# EasyEDA Pro project 交换机工具.epro, board PCB3
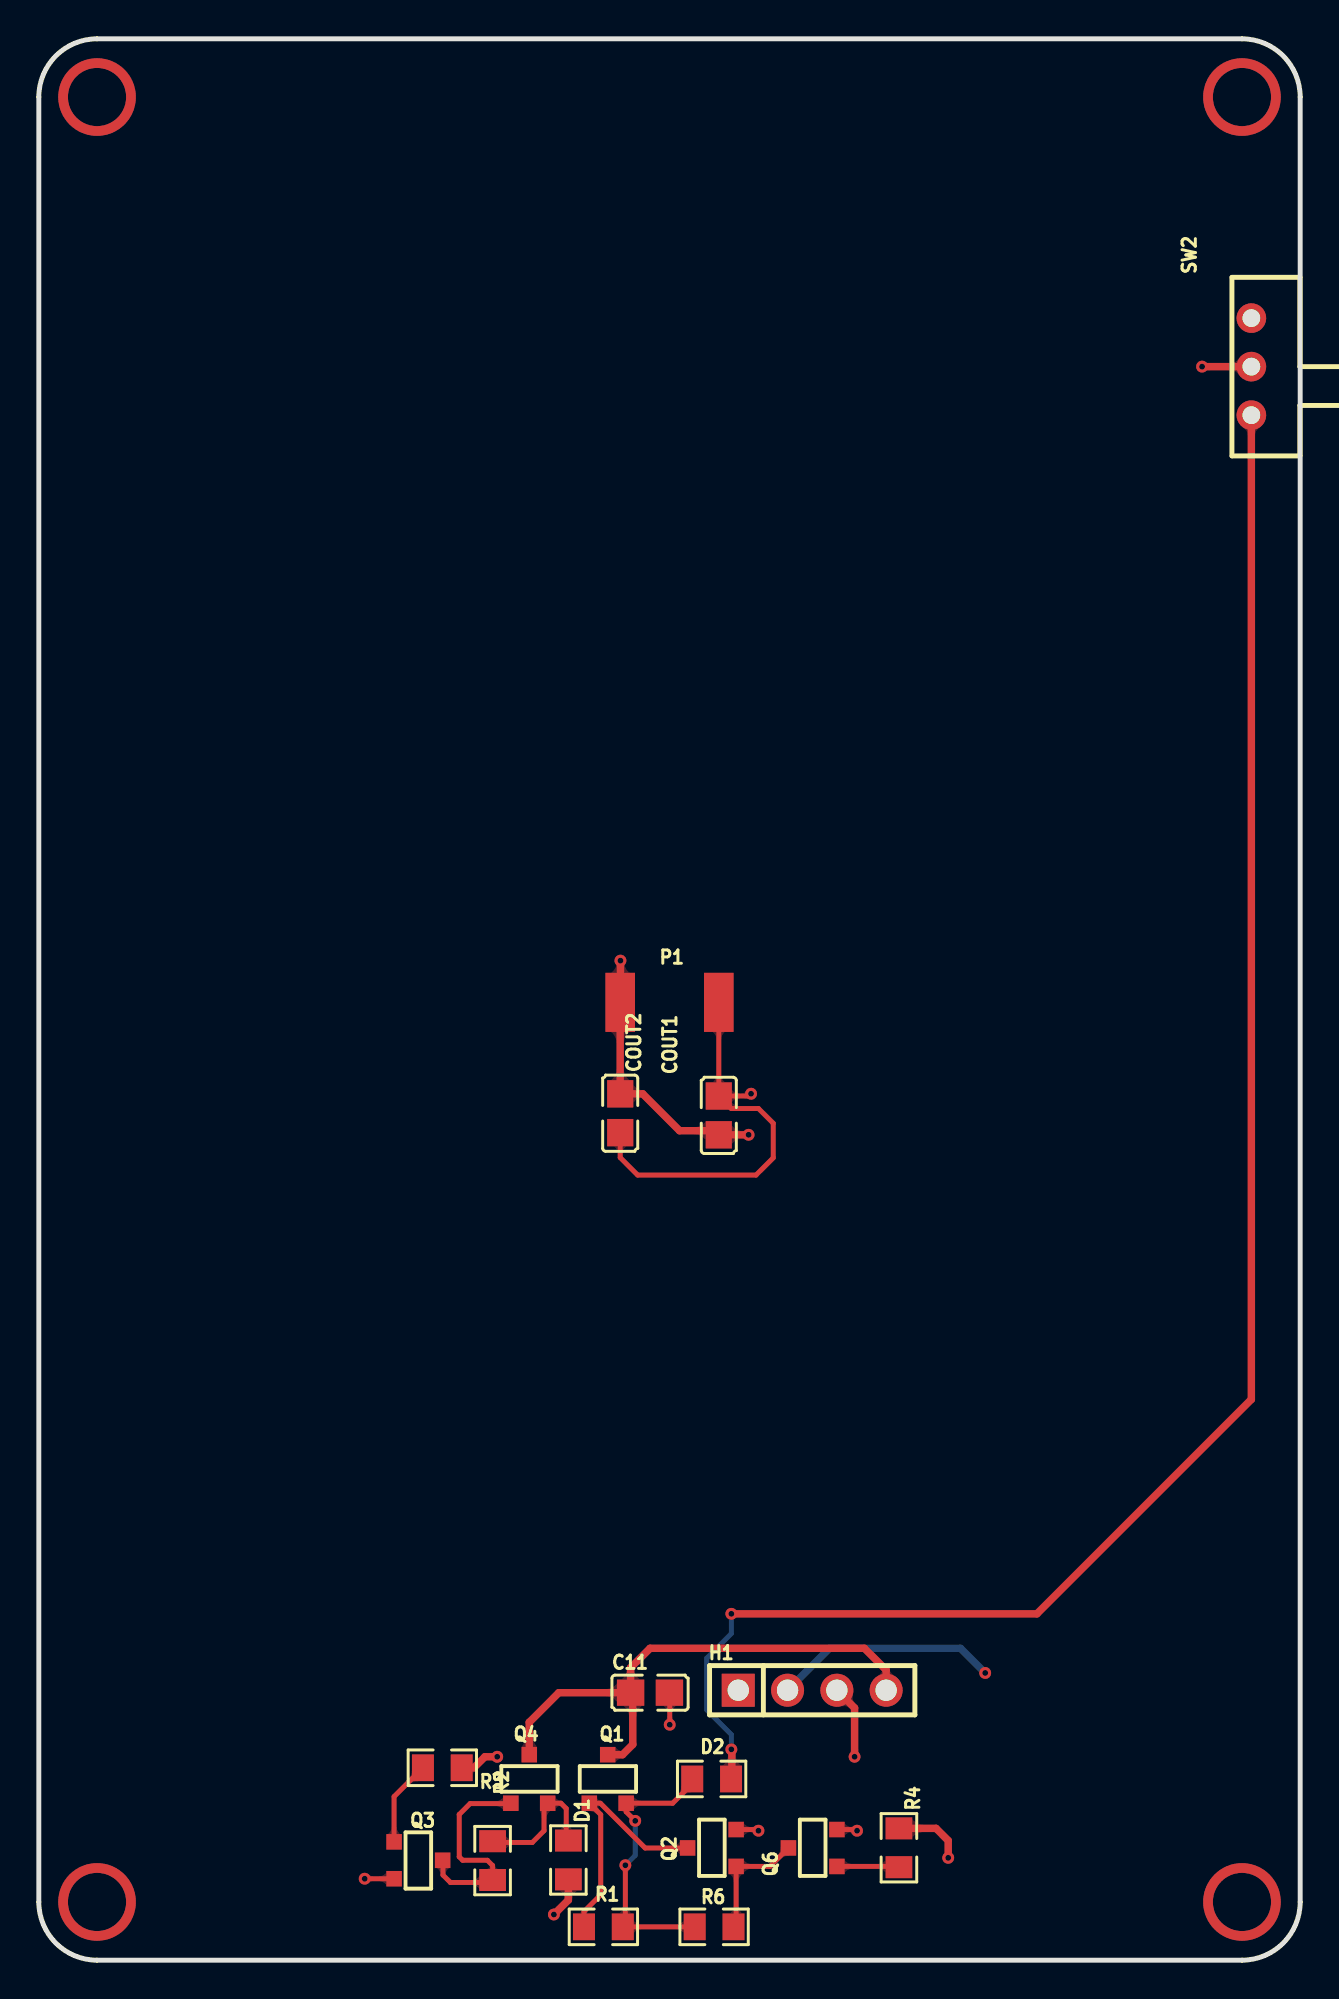
[diagram p2: board, top side]
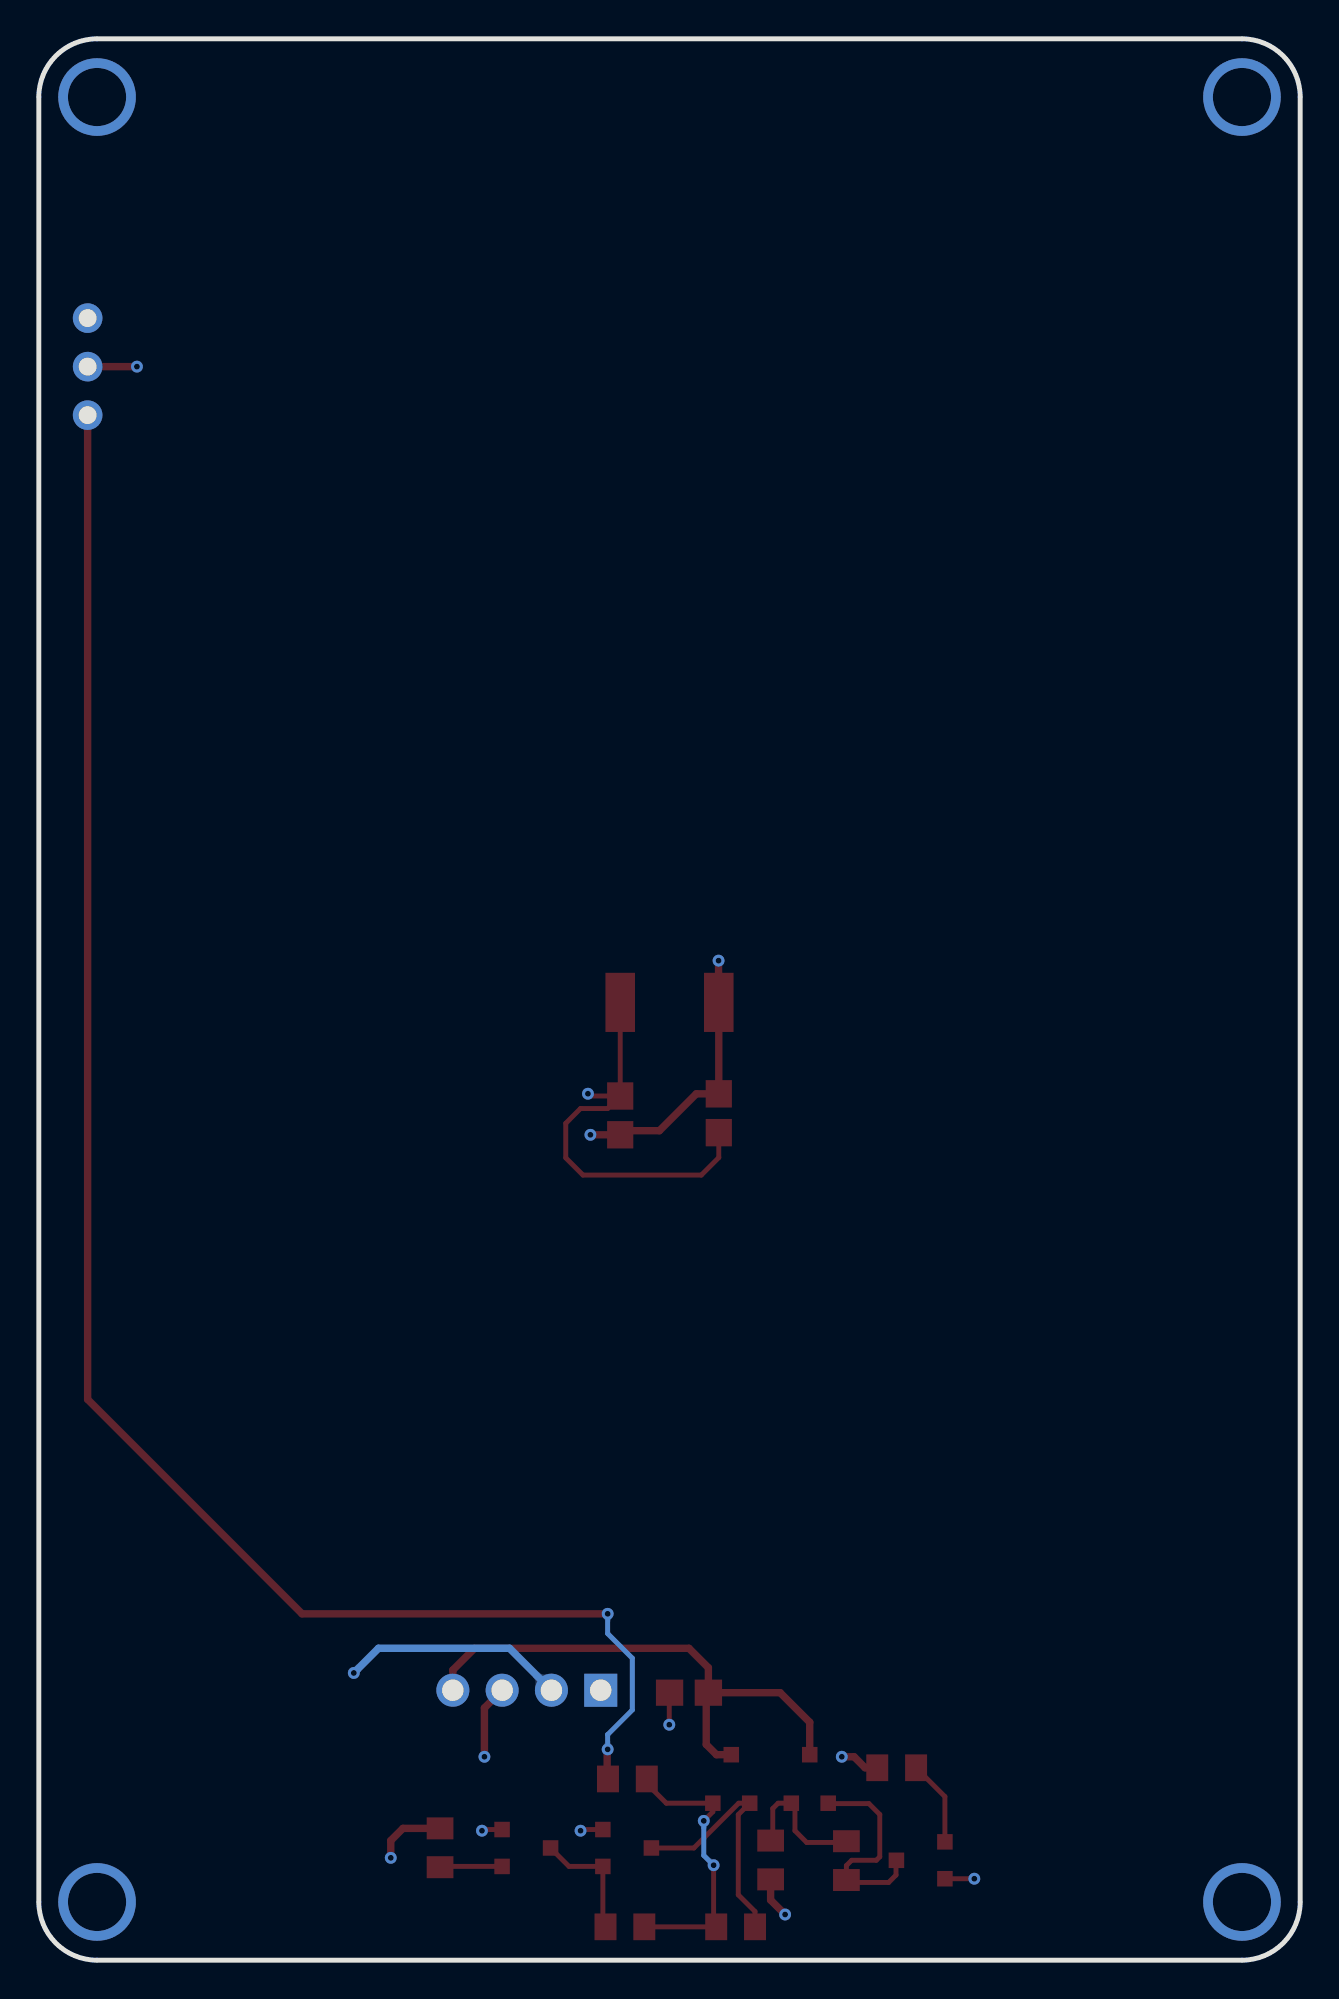
[diagram p3: board, bottom side, seen from below]

Outline 65 x 99 mm; copper layers: Top Layer, GND, PWR, Bottom Layer. Coordinates in mm from the lower left corner of the outline.
Outline path: 0,96 0,3 arc(0.88,0.88) 3,0 62,0 arc(64.12,0.88) 65,3 65,96 arc(64.12,98.12) 62,99 3,99 arc(0.88,98.12) 0,96
Stack: Top Layer 0.035mm 外层铜厚1oz / Dielectric1 0.2104mm 7628 RC49% 8.6mil / GND 0.0152mm 内层铜厚 / Dielectric2 1.065mm 1.1mm H/HOZ Copper / PWR 0.0152mm 内层铜厚 / Dielectric3 0.2104mm 7628 RC49% 8.6mil / Bottom Layer 0.035mm 外层铜厚1oz

## Design rules (mm)
template: JLCPCB Capability(Two Layers Board)
spacing copperThickness1oz (default): track to track 0.102, other pairs 0.152 to 0.3
spacing copperThickness2oz: track to track 0.203, other pairs 0.152 to 0.3
track width copperThickness1oz (default): min 0.127, default 0.254, max 2.54
track width copperThickness2oz: min 0.203, default 0.254, max 2.54
differential pair differentialPair (default): width min 0.127, default 0.254, max 2.54; gap min 0.152, default 0.152
via viaSize (default): diameter min 0.5, default 0.61, max 10; hole min 0.3, default 0.305, max 6.3

## Placement (name value [footprint] x y rotation side)
C11  0.1u  [C0805]  31.5 13.78 180 top
COUT1  22uF  [C0805]  35.04 43.53 270 top
COUT2  22uF  [C0805]  29.96 43.64 270 top
D1  1N5819W  [D0805]  27.29 5.16 270 top
D2  1N5819W  [D0805]  34.67 9.34 0 top
H1  2.54-1*4P母  [HDR-TH_4P-P2.54-V-F]  39.85 13.91 0 top
P1  锂电池连接焊盘  [3.7V电池]  35.04 49.35 90 top
Q1  AO3401A  [SOT-23-3_L2.9-W1.5-P1.90-LS2.6-BL]  29.32 9.34 0 top
Q2  MMBT3904  [SOT-23-3_L2.9-W1.5-P1.90-LS2.6-BL]  34.68 5.78 90 top
Q3  MMBT3904  [SOT-23-3_L2.9-W1.5-P1.90-LS2.6-BL]  19.56 5.15 270 top
Q4  AO3401A  [SOT-23-3_L2.9-W1.5-P1.90-LS2.6-BL]  25.27 9.34 0 top
Q6  MMBT3904  [SOT-23-3_L2.9-W1.5-P1.90-LS2.6-BL]  39.88 5.78 90 top
R1  10k  [R0805]  29.09 1.72 180 top
R2  10k  [R0805]  23.38 5.13 270 top
R3  10k  [R0805]  20.79 9.91 180 top
R4  10k  [R0805]  44.32 5.79 270 top
R6  10k  [R0805]  34.8 1.72 0 top
SW2  MSK-12D19  [SW-TH_MSK-12D19H]  62.48 82.11 270 top

## Footprints (pads in the part's own frame, mm; a bottom-side part is the same pattern mirrored in y, then rotated)
3.7V电池
  rect 3.048x1.524 smd: 1(0,5.08) 2(0,0)
C0805
  rect 1.41x1.35 smd: 1(-1,0) 2(1,0)
D0805
  rect 1.133x1.377 smd: 1(-1,0) 2(1,0)
HDR-TH_4P-P2.54-V-F
  rect 1.7x1.7 hole 1.1: 1(-3.81,0)
  round 1.7 hole 1.1: 2(-1.27,0) 3(1.27,0) 4(3.81,0)
R0805
  rect 1.133x1.377 smd: 1(-1,0) 2(1,0)
SOT-23-3_L2.9-W1.5-P1.90-LS2.6-BL
  rect 0.8x0.8 smd: 1(-0.95,-1.25) 2(0.95,-1.25) 3(0,1.25)
SW-TH_MSK-12D19H
  round 1.524 hole 0.914: 1(-2.5,0) 2(0,0) 3(2.5,0)

## Nets
As in the schematic.

Pads without a net: SW2 1

## Via types
v1: diameter 4, hole 3, Top Layer to Bottom Layer, 4 vias
v2: diameter 0.61, hole 0.305, Top Layer to Bottom Layer, 17 vias

## Routing (per net, layer and track width the routed paths; a pad name or vN(x,y) marks a point on that pad's centre or on a via; arc(x,y) is an arc through that point)
GND: length 27
  Top Layer w0.254: COUT2.2 29.96,41.35 30.86,40.45 36.96,40.45 37.85,41.34 37.85,43.12 37.08,43.88 35.69,43.88 COUT1.1 ; C11.1 32.51,13.77 v2(32.51,12.13) ; Q3.2 v2(16.79,4.2) ; v2(37.08,6.67) 37.02,6.73 Q2.2 ; COUT1.1 P1.2 ; COUT1.1 36.59,44.53 v2(36.7,44.64) ; Q6.2 42.1,6.73 v2(42.16,6.67)
VBUS: length 11.2
  Top Layer w0.381: D1.2 27.29,3.1 v2(26.54,2.35) ; 46.86,5.53 46.86,6.16 46.23,6.79 R4.1 ; 23.37,10.48 22.99,10.48 22.42,9.91 R3.1 ; v2(42.04,10.48) 42.04,13 H1.3
  vias: v2(23.62,10.48) v2(46.86,5.27)
(no net):
  vias: v1(3,96) v1(3,3) v1(62,96) v1(62,3)
BAT+: length 28.5
  Top Layer w0.381: SW2.2 v2(59.94,82.11) ; v2(36.58,42.53) COUT1.2 34.83,42.74 33.02,42.74 31.12,44.64 COUT2.1 P1.1 29.97,49.36 v2(29.97,51.5)
  Bottom Layer w0.381: v2(48.77,14.8) 47.5,16.07 40.74,16.07 H1.2
BAT_VIN+: length 91.7
  Top Layer w0.381: v2(35.69,17.85) 51.44,17.85 62.48,28.9 SW2.3 ; D2.2 35.71,9.38 35.71,10.84 v2(35.69,10.86)
  Bottom Layer w0.254: v2(35.69,17.85) 35.69,16.83 34.42,15.56 34.42,12.89 35.69,11.62 v2(35.69,10.86)
VOUT: length 28.1
  Top Layer w0.381: C11.2 30.5,15.07 31.5,16.07 42.54,16.07 43.66,14.95 H1.4 ; C11.2 30.61,13.67 30.61,11.12 30.08,10.59 Q1.3 ; C11.2 26.8,13.78 25.27,12.26 Q4.3
$1N864: length 6.3
  Top Layer w0.254: Q6.3 37.68,4.83 Q2.1 35.93,1.85 R6.2
$1N866: length 13
  Top Layer w0.254: R1.2 28.09,2.51 28.96,3.37 28.96,7.5 Q1.1 28.94,8.09 31.24,5.78 Q2.3
$1N867: length 7.2
  Top Layer w0.254: R2.1 23.51,6.13 23.57,6.06 25.43,6.06 26.03,6.67 26.03,7.9 26.22,8.09 26.9,8.09 27.18,7.81 27.18,6.27 D1.1
$1N868: length 14.4
  Top Layer w0.254: v2(30.73,7.18) 30.27,7.65 Q1.2 32.66,8.09 33.8,9.22 ; R6.1 R1.1 30.23,1.85 30.23,4.77
  Bottom Layer w0.254: v2(30.23,4.89) 30.73,5.4 v2(30.73,7.18)
$1N875: length 3.2
  Top Layer w0.254: R4.2 44.28,4.83 Q6.1
$1N878: length 11.3
  Top Layer w0.254: Q3.3 20.83,5.13 20.83,4.38 21.21,4 23.26,4 R2.2 23.38,4.88 23.11,5.15 21.84,5.15 21.66,5.33 21.66,7.51 22.22,8.07 24.3,8.07 Q4.1
$1N879: length 4.4
  Top Layer w0.254: R3.2 18.31,8.43 Q3.1

## Copper pours and planes (outline as drawn; the poured copper is in the pictures)
GND on GND: 0.26,98.74 64.74,98.74 64.74,0.26 0.26,0.26
VBUS on PWR: 21.53,11.94 47.82,11.94 47.82,0.89 21.53,0.89
(no net) on PWR: 0.26,98.74 64.74,98.74 64.74,0.26 0.26,0.26
BAT+ on PWR: 23.18,87.25 63.56,87.25 63.56,11.69 23.18,11.69

Small or netless copper shapes (teardrops, artwork), in the pictures only: 67 on Top Layer, 6 on Bottom Layer, 4 on GND, 3 on PWR
